# EAGLE design Skaarhoj_BI8-1x12CAP3slim (EAGLE 6.5.0)
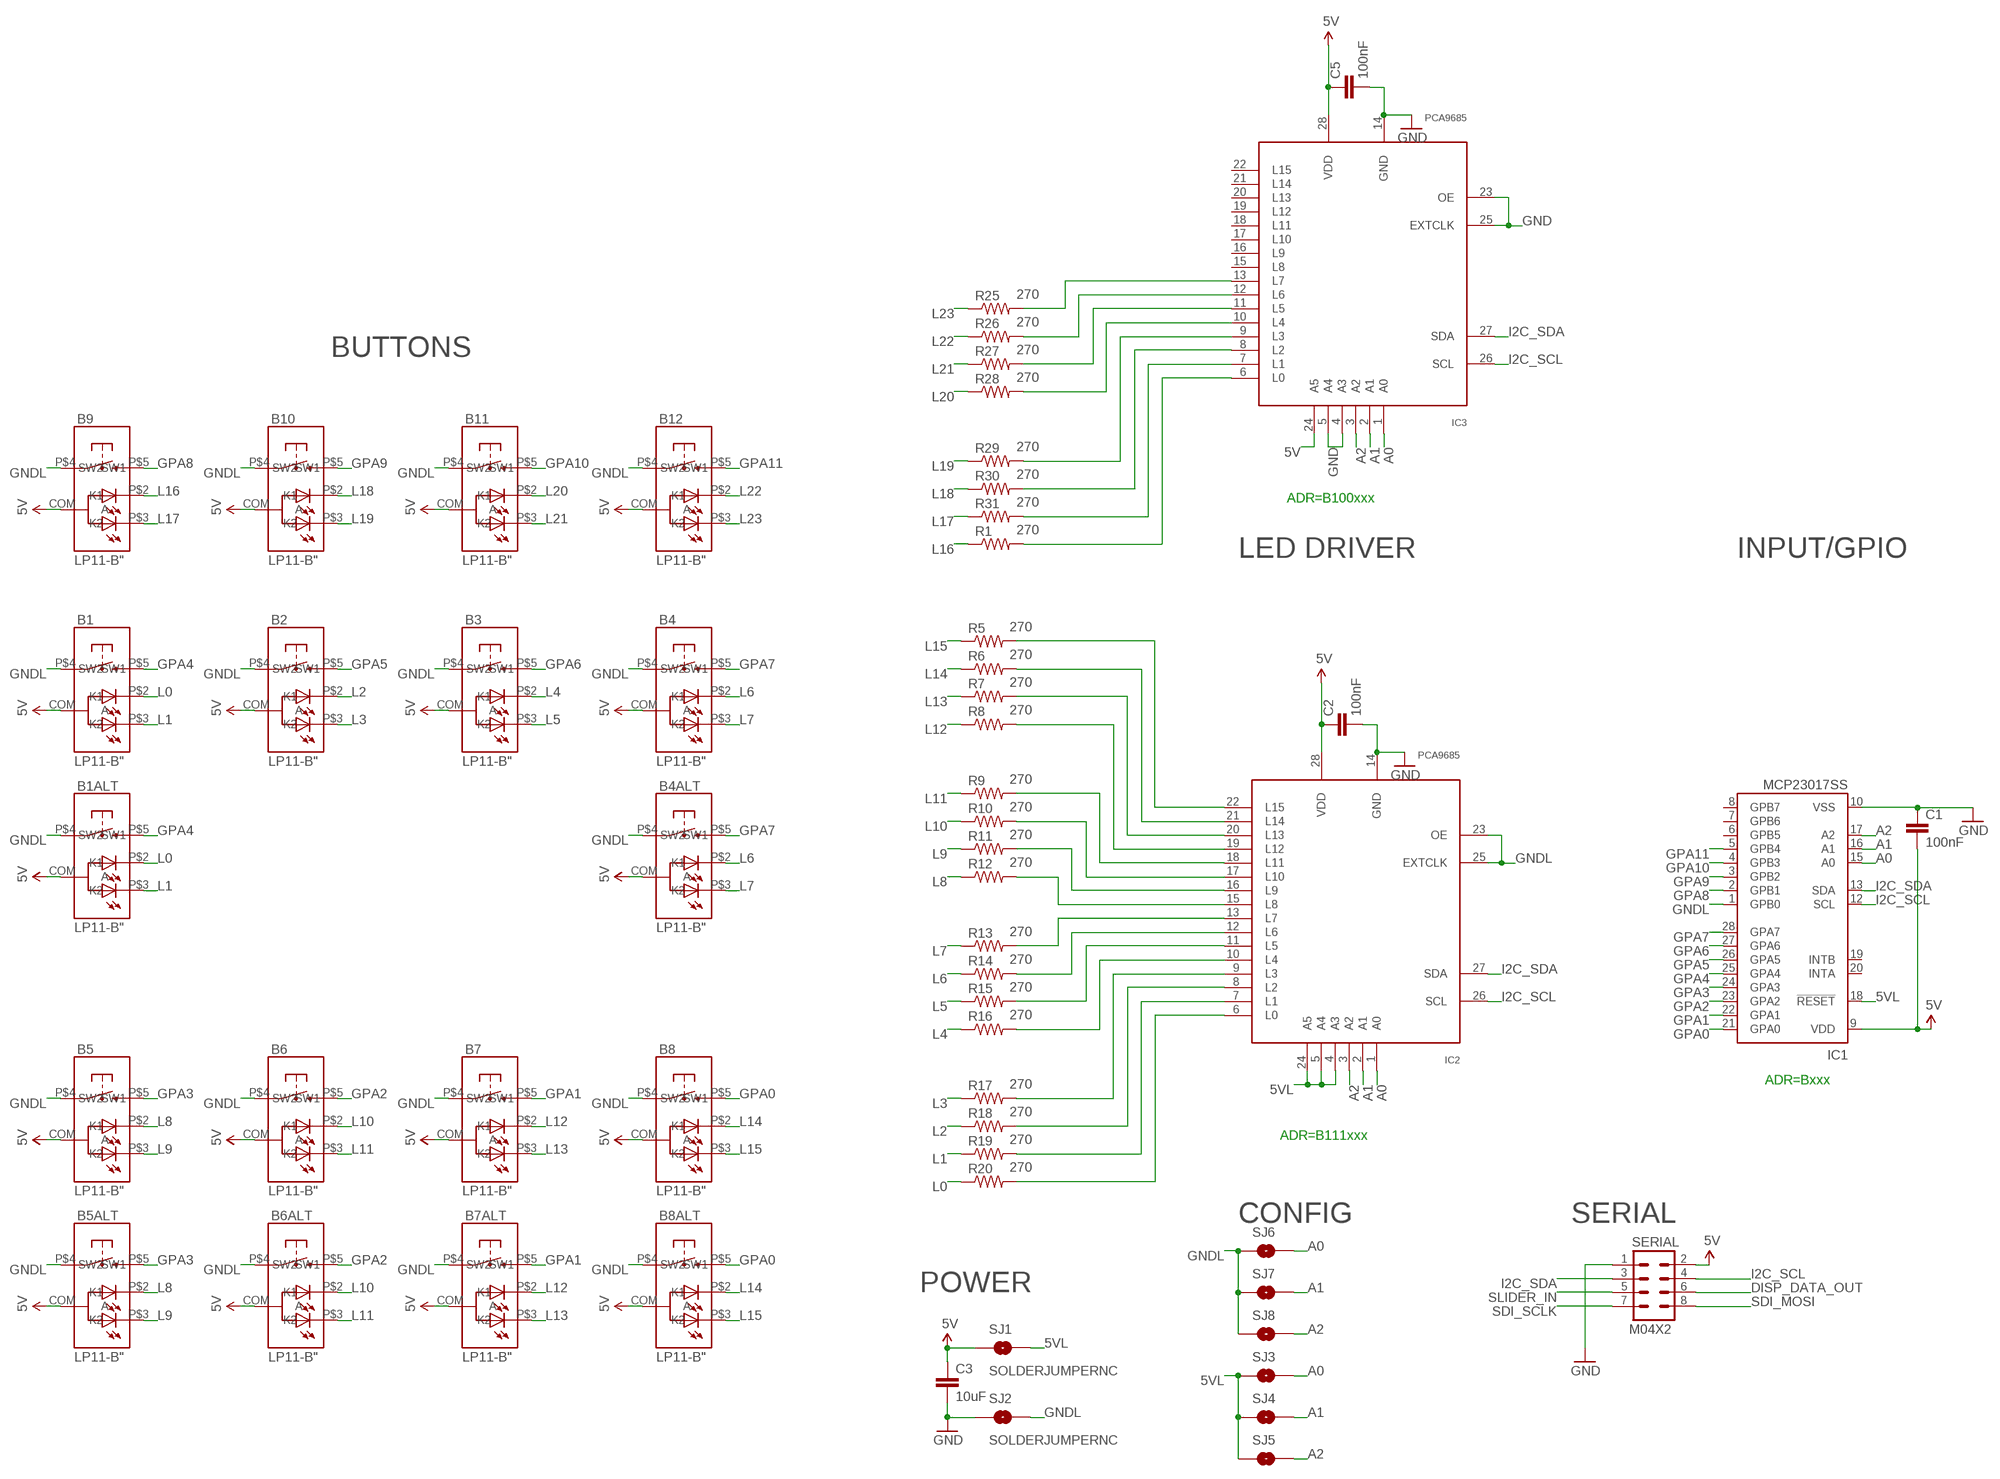
[diagram p0: schematic, sheet 1]

## Parts
B1  LP11-B"  [LP11]
B1ALT  LP11-B"  [LP11]
B2  LP11-B"  [LP11]
B3  LP11-B"  [LP11]
B4  LP11-B"  [LP11]
B4ALT  LP11-B"  [LP11]
B5  LP11-B"  [LP11]
B5ALT  LP11-B"  [LP11]
B6  LP11-B"  [LP11]
B6ALT  LP11-B"  [LP11]
B7  LP11-B"  [LP11]
B7ALT  LP11-B"  [LP11]
B8  LP11-B"  [LP11]
B8ALT  LP11-B"  [LP11]
B9  LP11-B"  [LP11]
B10  LP11-B"  [LP11]
B11  LP11-B"  [LP11]
B12  LP11-B"  [LP11]
C1  100nF  CAP0603-CAP  [0603-CAP]
C2  100nF  CAP0603-CAP  [0603-CAP]
C3  10uF  CAP0805  [0805]
C5  100nF  CAP0603-CAP  [0603-CAP]
IC1  MCP23017SS  [SSOP28]
IC2  PCA9685  [TSSOP28]
IC3  PCA9685  [TSSOP28]
R1  270  RESISTOR0603-RES  [0603-RES]
R5  270  RESISTOR0603-RES  [0603-RES]
R6  270  RESISTOR0603-RES  [0603-RES]
R7  270  RESISTOR0603-RES  [0603-RES]
R8  270  RESISTOR0603-RES  [0603-RES]
R9  270  RESISTOR0603-RES  [0603-RES]
R10  270  RESISTOR0603-RES  [0603-RES]
R11  270  RESISTOR0603-RES  [0603-RES]
R12  270  RESISTOR0603-RES  [0603-RES]
R13  270  RESISTOR0603-RES  [0603-RES]
R14  270  RESISTOR0603-RES  [0603-RES]
R15  270  RESISTOR0603-RES  [0603-RES]
R16  270  RESISTOR0603-RES  [0603-RES]
R17  270  RESISTOR0603-RES  [0603-RES]
R18  270  RESISTOR0603-RES  [0603-RES]
R19  270  RESISTOR0603-RES  [0603-RES]
R20  270  RESISTOR0603-RES  [0603-RES]
R25  270  RESISTOR0603-RES  [0603-RES]
R26  270  RESISTOR0603-RES  [0603-RES]
R27  270  RESISTOR0603-RES  [0603-RES]
R28  270  RESISTOR0603-RES  [0603-RES]
R29  270  RESISTOR0603-RES  [0603-RES]
R30  270  RESISTOR0603-RES  [0603-RES]
R31  270  RESISTOR0603-RES  [0603-RES]
SERIAL  M04X2  [2X4]
SJ1  SOLDERJUMPERNC  [SJ_2S]
SJ2  SOLDERJUMPERNC  [SJ_2S]
SJ3  SOLDERJUMPERNC  [SJ_2S]
SJ4  SOLDERJUMPERNC  [SJ_2S]
SJ5  SOLDERJUMPERNC  [SJ_2S]
SJ6  SOLDERJUMPERNC  [SJ_2S]
SJ7  SOLDERJUMPERNC  [SJ_2S]
SJ8  SOLDERJUMPERNC  [SJ_2S]

## Nets
5V [Power]: B1.COM(A) B1ALT.COM(A) B2.COM(A) B3.COM(A) B4.COM(A) B4ALT.COM(A) B5.COM(A) B5ALT.COM(A) B6.COM(A) B6ALT.COM(A) B7.COM(A) B7ALT.COM(A) B8.COM(A) B8ALT.COM(A) B9.COM(A) B10.COM(A) B11.COM(A) B12.COM(A) C1.2 C2.1 C3.1 C5.1 IC1.9(VDD) IC2.28(VDD) IC3.24(A5) IC3.28(VDD) SERIAL.2 SJ1.1
5VL: IC1.18(!RESET) IC2.4(A3) IC2.5(A4) IC2.24(A5) SJ1.2 SJ3.1 SJ4.1 SJ5.1
A0: IC1.15(A0) IC2.1(A0) IC3.1(A0) SJ3.2 SJ6.2
A1: IC1.16(A1) IC2.2(A1) IC3.2(A1) SJ4.2 SJ7.2
A2: IC1.17(A2) IC2.3(A2) IC3.3(A2) SJ5.2 SJ8.2
DISP_DATA_OUT: SERIAL.6
GND [Power]: C1.1 C2.2 C3.2 C5.2 IC1.10(VSS) IC2.14(GND) IC3.4(A3) IC3.5(A4) IC3.14(GND) IC3.23(OE) IC3.25(EXTCLK) SERIAL.1 SJ2.1
GNDL: B1.P$4(SW1) B1ALT.P$4(SW1) B2.P$4(SW1) B3.P$4(SW1) B4.P$4(SW1) B4ALT.P$4(SW1) B5.P$4(SW1) B5ALT.P$4(SW1) B6.P$4(SW1) B6ALT.P$4(SW1) B7.P$4(SW1) B7ALT.P$4(SW1) B8.P$4(SW1) B8ALT.P$4(SW1) B9.P$4(SW1) B10.P$4(SW1) B11.P$4(SW1) B12.P$4(SW1) IC1.1(GPB0) IC2.23(OE) IC2.25(EXTCLK) SJ2.2 SJ6.1 SJ7.1 SJ8.1
GPA0: B8.P$5(SW2) B8ALT.P$5(SW2) IC1.21(GPA0)
GPA1: B7.P$5(SW2) B7ALT.P$5(SW2) IC1.22(GPA1)
GPA2: B6.P$5(SW2) B6ALT.P$5(SW2) IC1.23(GPA2)
GPA3: B5.P$5(SW2) B5ALT.P$5(SW2) IC1.24(GPA3)
GPA4: B1.P$5(SW2) B1ALT.P$5(SW2) IC1.25(GPA4)
GPA5: B2.P$5(SW2) IC1.26(GPA5)
GPA6: B3.P$5(SW2) IC1.27(GPA6)
GPA7: B4.P$5(SW2) B4ALT.P$5(SW2) IC1.28(GPA7)
GPA8: B9.P$5(SW2) IC1.2(GPB1)
GPA9: B10.P$5(SW2) IC1.3(GPB2)
GPA10: B11.P$5(SW2) IC1.4(GPB3)
GPA11: B12.P$5(SW2) IC1.5(GPB4)
I2C_SCL: IC1.12(SCL) IC2.26(SCL) IC3.26(SCL) SERIAL.4
I2C_SDA: IC1.13(SDA) IC2.27(SDA) IC3.27(SDA) SERIAL.3
L0: B1.P$2(K1) B1ALT.P$2(K1) R20.1
L1: B1.P$3(K2) B1ALT.P$3(K2) R19.1
L2: B2.P$2(K1) R18.1
L3: B2.P$3(K2) R17.1
L4: B3.P$2(K1) R16.1
L5: B3.P$3(K2) R15.1
L6: B4.P$2(K1) B4ALT.P$2(K1) R14.1
L7: B4.P$3(K2) B4ALT.P$3(K2) R13.1
L8: B5.P$2(K1) B5ALT.P$2(K1) R12.1
L9: B5.P$3(K2) B5ALT.P$3(K2) R11.1
L10: B6.P$2(K1) B6ALT.P$2(K1) R10.1
L11: B6.P$3(K2) B6ALT.P$3(K2) R9.1
L12: B7.P$2(K1) B7ALT.P$2(K1) R8.1
L13: B7.P$3(K2) B7ALT.P$3(K2) R7.1
L14: B8.P$2(K1) B8ALT.P$2(K1) R6.1
L15: B8.P$3(K2) B8ALT.P$3(K2) R5.1
L16: B9.P$2(K1) R1.1
L17: B9.P$3(K2) R31.1
L18: B10.P$2(K1) R30.1
L19: B10.P$3(K2) R29.1
L20: B11.P$2(K1) R28.1
L21: B11.P$3(K2) R27.1
L22: B12.P$2(K1) R26.1
L23: B12.P$3(K2) R25.1
N$1: IC3.13(L7) R25.2
N$2: IC3.12(L6) R26.2
N$3: IC3.11(L5) R27.2
N$4: IC2.13(L7) R13.2
N$5: IC2.12(L6) R14.2
N$6: IC3.10(L4) R28.2
N$7: IC2.11(L5) R15.2
N$8: IC3.9(L3) R29.2
N$9: IC2.10(L4) R16.2
N$10: IC2.9(L3) R17.2
N$11: IC2.8(L2) R18.2
N$12: IC2.7(L1) R19.2
N$13: IC3.8(L2) R30.2
N$14: IC3.7(L1) R31.2
N$15: IC3.6(L0) R1.2
N$19: IC2.6(L0) R20.2
N$20: IC2.15(L8) R12.2
N$21: IC2.16(L9) R11.2
N$22: IC2.17(L10) R10.2
N$23: IC2.18(L11) R9.2
N$24: IC2.19(L12) R8.2
N$25: IC2.20(L13) R7.2
N$26: IC2.21(L14) R6.2
N$27: IC2.22(L15) R5.2
SDI_MOSI: SERIAL.8
SDI_SCLK: SERIAL.7
SLIDER_IN: SERIAL.5
Unconnected: IC1.6(GPB5) IC1.7(GPB6) IC1.8(GPB7) IC1.19(INTB) IC1.20(INTA) IC3.15(L8) IC3.16(L9) IC3.17(L10) IC3.18(L11) IC3.19(L12) IC3.20(L13) IC3.21(L14) IC3.22(L15)

## Notes on the sheet
- BUTTONS
- ADR=B100xxx
- LED DRIVER | INPUT/GPIO
- ADR=Bxxx
- ADR=B111xxx
- CONFIG | SERIAL
- POWER

## Library data of the parts
B1 B1ALT B2-B4 B4ALT B5 B5ALT B6 B6ALT B7 B7ALT B8 B8ALT B9-B12 = SKAARHOJ:LP11-B
C1-C3 C5 = SparkFun:CAP: Capacitor Standard 0603 ceramic capacitor, and 0.1" leaded capacitor.
IC1 = microchip:MCP23017: http://ww1.microchip.com/downloads/en/DeviceDoc/21952a.pdf Source: http://ww1.microchip.com/downloads/en/DeviceDoc/21952a.pdf; MF: MICROCHIP; MPN: MCP23017-E/SS; OC_FARNELL: 1467674; OC_NEWARK: 31K2960
IC2 IC3 = wsmith:PCA9685
R1 R5-R20 R25-R31 = SparkFun:RESISTOR: Resistor Basic schematic elements and footprints for 0603, 1206, and PTH resistors.
SERIAL = SparkFun:M04X2
SJ1-SJ8 = SparkFun:SOLDERJUMPER: Solder Jumper Standard SMD solder jumper. Used to automate production. Two varients : Normally Open and Normally Closed are the same, but have different paste layers. NC will have a large amount of paste and should jumper during reflow.

## Net classes
0 default: width 0.152 mm, drill 0.406 mm, clearance 0.152 mm
1 Power: width 0.406 mm, drill 0.61 mm, clearance 0.152 mm

## Board
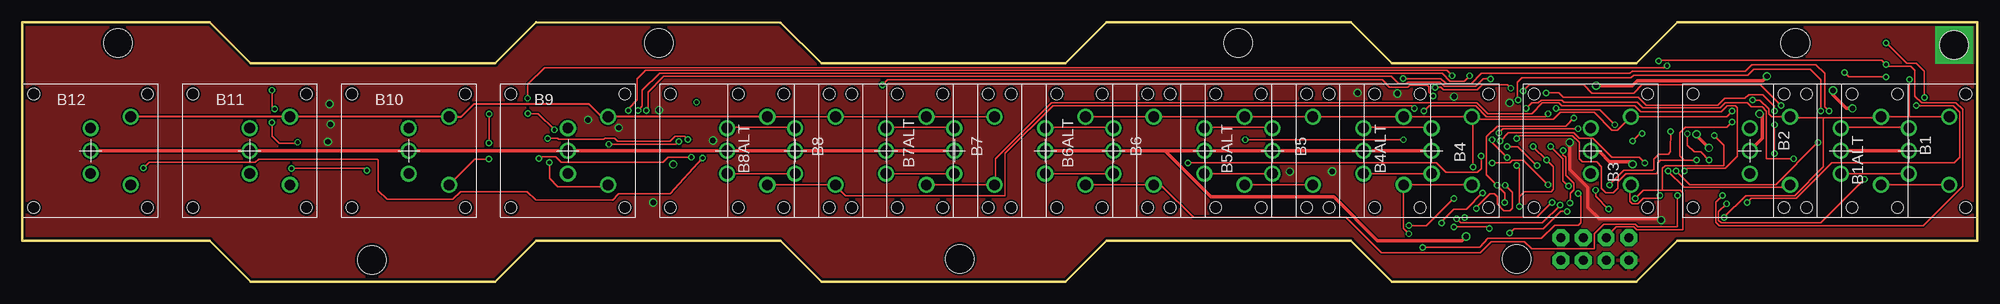
[diagram p1: board, top side]
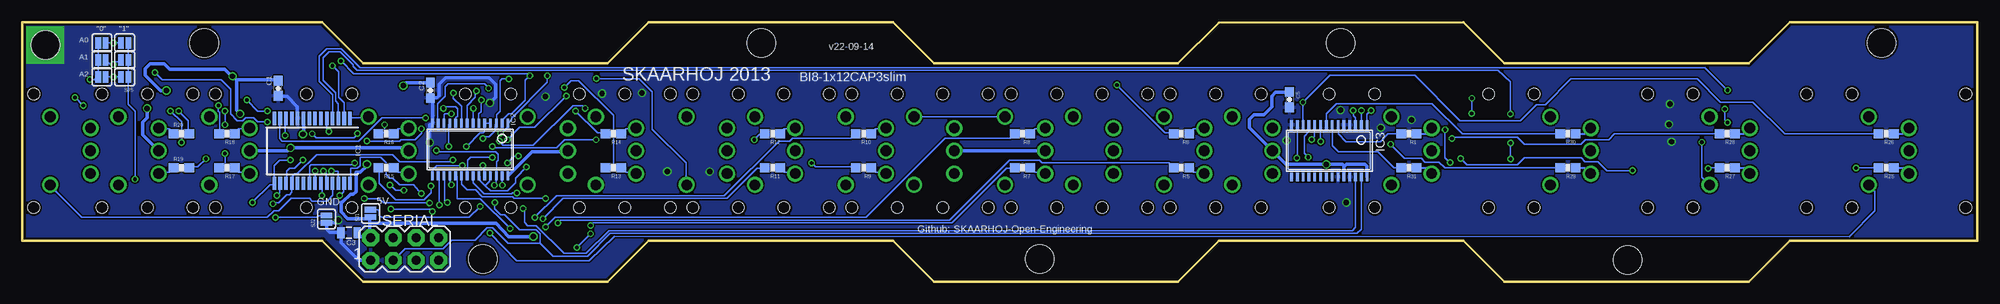
[diagram p2: board, bottom side, seen from below]

Size 218.44 x 28.96 mm. Coordinates in mm from the lower left corner, seen from the top.
Outline: 0,28.96 20.95,28.96 25.53,24.38 52.83,24.38 57.4,28.96 84.71,28.93 89.28,24.38 116.59,24.38 121.16,28.96 148.46,28.96 153.03,24.38 180.34,24.38 184.91,28.96 218.44,28.96 218.44,4.57 184.91,4.57 180.34,0 153.03,0 148.46,4.57 121.16,4.57 116.59,0 89.28,0 84.71,4.57 57.4,4.57 52.83,0 25.53,0 20.95,4.57 0,4.57 0,28.96
Copper layers (1*16): Top 0.035mm / dielectric 1.5mm / Bottom 0.035mm
Design rules "Fusion_eagle_rule_v1.1": minimum track width 6mil, minimum drill 12mil, track to track 6mil, track to pad 6mil, pad to pad 6mil, via to via 6mil, smd to smd 0mil, copper to edge 10mil, drill to drill 10mil, minimum pad ring 10mil, minimum via ring 6mil, stop-mask expansion 2mil, vias tented up to drill 100mil, thermal gap 10mil
Holes 3.2 mm at 71.12,26.67 104.77,2.54 167,2.54 135.89,26.67 198.12,26.67 39.07,2.41 215.87,26.44 10.67,26.67

### Footprints (pad centres in the part's own frame; a part is rotated, then mirrored left to right if it is on the bottom)
LP11 = drill 1.2: COM 0,0; P$2 0,2.54; P$3 0,-2.54; P$4 4.5,3.81; P$5 4.5,-3.81 | hole 1.3: -6.35,6.35; 6.35,6.35; 6.35,-6.35; -6.35,-6.35
0603-CAP = smd 1.1 x 1: 1 -0.85,0; 2 0.85,0
0805 = smd 0.8 x 1.2: 1 -0.9,0; 2 0.9,0
SSOP28 = smd 0.4 x 1.5: 1 -4.225,-3.625; 2 -3.575,-3.625; 3 -2.925,-3.625; 4 -2.275,-3.625; 5 -1.625,-3.625; 6 -0.975,-3.625; 7 -0.325,-3.625; 8 0.325,-3.625; 9 0.975,-3.625; 10 1.625,-3.625; 11 2.275,-3.625; 12 2.925,-3.625; 13 3.575,-3.625; 14 4.225,-3.625; 15 4.225,3.625; 16 3.575,3.625; 17 2.925,3.625; 18 2.275,3.625; 19 1.625,3.625; 20 0.975,3.625; 21 0.325,3.625; 22 -0.325,3.625; 23 -0.975,3.625; 24 -1.625,3.625; 25 -2.275,3.625; 26 -2.925,3.625; 27 -3.575,3.625; 28 -4.225,3.625
TSSOP28 = smd 0.305 x 0.991: 1 -4.225,-2.918; 2 -3.575,-2.918; 3 -2.925,-2.918; 4 -2.275,-2.918; 5 -1.625,-2.918; 6 -0.975,-2.918; 7 -0.325,-2.918; 8 0.325,-2.918; 9 0.975,-2.918; 10 1.625,-2.918; 11 2.275,-2.918; 12 2.925,-2.918; 13 3.575,-2.918; 14 4.225,-2.918; 15 4.225,2.918; 16 3.575,2.918; 17 2.925,2.918; 18 2.275,2.918; 19 1.625,2.918; 20 0.975,2.918; 21 0.325,2.918; 22 -0.325,2.918; 23 -0.975,2.918; 24 -1.625,2.918; 25 -2.275,2.918; 26 -2.925,2.918; 27 -3.575,2.918; 28 -4.225,2.918
0603-RES = smd 1.1 x 1: 1 -0.85,0; 2 0.85,0
2X4 = drill 1.016 pad 1.88 octagon: 1 -3.81,-1.27; 2 -3.81,1.27; 3 -1.27,-1.27; 4 -1.27,1.27; 5 1.27,-1.27; 6 1.27,1.27; 7 3.81,-1.27; 8 3.81,1.27
SJ_2S = smd 0.635 x 1.27: 1 -0.412,0; 2 0.412,0

### Placement (x,y rotation side)
B1  210.82,14.61 0 top
B1ALT  203.2,14.61 0 top
B2  193.04,14.61 0 top
B3  175.26,14.61 0 top
B4  157.48,14.61 0 top
B4ALT  149.86,14.61 0 top
B5  139.7,14.61 0 top
B5ALT  132.08,14.61 0 top
B6  121.92,14.61 0 top
B6ALT  114.3,14.61 0 top
B7  104.14,14.61 0 top
B7ALT  96.52,14.61 0 top
B8  86.36,14.61 0 top
B8ALT  78.74,14.61 0 top
B9  60.96,14.61 0 top
B10  43.18,14.61 0 top
B11  25.4,14.61 0 top
B12  7.62,14.61 0 top
C1  189.87,21.59 90 bottom
C2  172.85,21.36 270 bottom
C3  181.94,5.46 180 bottom
C5  76.83,20.32 270 bottom
IC1  186.06,14.61 180 bottom
IC2  168.4,14.76 180 bottom
IC3  72.39,14.61 180 bottom
R1  63.5,16.51 180 bottom
R5  88.9,12.7 180 bottom
R6  88.9,16.51 180 bottom
R7  106.68,12.7 180 bottom
R8  106.68,16.51 180 bottom
R9  124.46,12.7 180 bottom
R10  124.46,16.51 180 bottom
R11  134.62,12.7 180 bottom
R12  134.62,16.51 180 bottom
R13  152.4,12.7 180 bottom
R14  152.4,16.51 180 bottom
R15  177.8,12.7 180 bottom
R16  177.8,16.51 180 bottom
R17  195.58,12.7 180 bottom
R18  195.58,16.51 180 bottom
R19  200.66,12.7 0 bottom
R20  200.66,16.51 0 bottom
R25  10.16,12.7 180 bottom
R26  10.16,16.51 180 bottom
R27  27.94,12.7 180 bottom
R28  27.94,16.51 180 bottom
R29  45.72,12.7 180 bottom
R30  45.72,16.51 180 bottom
R31  63.5,12.7 180 bottom
SERIAL  175.72,3.63 0 bottom
SJ1  179.53,7.62 90 bottom
SJ2  184.45,6.98 90 bottom
SJ3  207.01,26.67 180 bottom
SJ4  207.01,24.77 180 bottom
SJ5  207.01,22.86 180 bottom
SJ6  209.55,26.67 0 bottom
SJ7  209.55,24.77 0 bottom
SJ8  209.55,22.86 0 bottom

### Tracks (layer width: path | path; a pad name or v marks a point on that pad's centre or on a via)
5V  (via drill 0.61)
  Top 0.406: v179.93,13.11 179.63,13.41 177.34,13.41 176.28,14.48 175.36,14.48 B3.COM | B1ALT.COM 203.25,14.63 210.72,14.63 B1.COM | v194.11,18.75 194.41,18.75 194.41,16 193.04,14.63 B2.COM | B7.COM 104.04,14.63 96.57,14.63 B7ALT.COM 96.42,14.63 86.51,14.63 B8.COM 86.36,14.63 78.74,14.63 B8ALT.COM B9.COM B10.COM B11.COM B12.COM | B4.COM 157.38,14.63 149.91,14.63 B4ALT.COM 149.76,14.63 139.85,14.63 B5.COM 139.7,14.63 132.08,14.63 B5ALT.COM 131.93,14.63 127.81,14.63 | B6ALT.COM 114.4,14.63 121.87,14.63 B6.COM 122.02,14.63 127.81,14.63 | v161.34,5.03 160.88,4.57 151.43,4.57 146.56,9.45 132.84,9.45 127.81,14.48 127.81,14.63 | v202.34,21.34 202.34,20.85 203.83,19.36 v204.5,19.36 | v187.1,16.46 187.1,16.31 v188.47,14.93 | v175.87,21.88 179.92,21.88 180.49,22.45 194.46,22.45 v194.94,22.94
  Bottom 0.406: C3.1 181,5.33 180.7,5.03 179.63,5.03 SERIAL.2 179.63,5.18 179.65,6.5 | 179.65,6.5 179.63,7.16 SJ1.1 179.78,7.01 182.07,7.01 182.83,7.77 182.83,8.84 182.68,8.84 181.76,9.75 181.46,9.75 181.15,10.06 181.15,12.19 180.7,12.19 179.93,12.95 v179.93,13.11 | B2.COM 193.04,14.63 188.77,14.63 v188.47,14.93 175.67,14.93 175.36,14.63 B3.COM | 173.08,22.4 172.92,22.25 C2.1 175.54,22.21 v175.87,21.88 | 189.84,22.4 C1.2 | 203.25,14.63 B1ALT.COM 205,16.41 205,17.8 204.5,18.31 v204.5,19.36 | C1.2 189.99,22.55 194.56,22.55 v194.94,22.94 | 189.84,22.25 C1.2 | IC2.28 164.08,11.89 161.49,14.48 157.53,14.48 B4.COM | B7.COM 104.19,14.63 114.25,14.63 B6ALT.COM | 179.65,6.5 165.49,6.5 164.1,5.03 v161.34,5.03 | IC3.24 | C5.1 78.39,21.17 78.83,20.73 78.83,19.51 79.68,18.66 80.81,18.66 81.31,18.16 81.31,17.17 B8ALT.COM 77.23,13.09 v72.72,13.09 70.93,13.09 70.69,12.86 | IC3.24 70.76,12.79 70.69,12.86 | IC3.28 68.16,12.86 68.39,13.08 70.47,13.08 70.69,12.86 | IC1.9 187.03,16.53 v187.1,16.46 | v194.11,18.75 194.49,19.13 194.49,22.48 v194.94,22.94 | v202.34,21.34 203,21.34 204.72,23.06 204.72,23.75 204.14,24.33 202.59,24.33 201.98,23.72 195.81,23.72 195.02,22.94 v194.94,22.94
5VL  (via drill 0.41)
  Top 0.152: v205.84,11.43 200.96,6.55 189.84,6.55 189.53,6.86 189.53,7.77 v190.45,8.69 | v166.98,12.95 167.28,12.65 167.28,9.45 | v167.28,8.38 167.28,9.45 | v168.81,15.09 v170.33,13.56 171.09,12.8 171.09,10.29 170.84,10.03 167.87,10.03 167.28,9.45
  Bottom 0.152: IC2.4 166.22,17.68 166.67,17.68 IC2.5 | SJ5.1 206.6,24.69 SJ4.1 206.6,24.84 SJ3.1 | SJ5.1 206.6,19.81 205.84,19.05 v205.84,11.43 | SJ5.1 | v167.28,8.38 168.5,7.16 178.31,7.16 178.55,7.4 178.55,7.87 178.69,8.01 179.51,8.01 SJ1.2 179.48,7.92 | IC2.24 166.83,11.89 166.83,12.8 v166.98,12.95 | v168.81,15.09 167.28,16.61 166.95,16.61 166.78,16.79 IC2.5 | 166.83,17.53 IC2.5 | v170.33,13.56 170.48,13.41 176.28,13.41 177.04,14.17 185.57,14.17 187.71,12.04 188.01,12.04 188.32,11.73 188.32,11.12 IC1.18 188.33,9.97 188.59,9.7 188.9,9.7 189.81,8.79 190.35,8.79 v190.45,8.69 | IC2.5
A0  (via drill 0.41)
  Top 0.152: v165,16.61 165.46,17.07 v173.84,17.07 | v188.47,13.56 187.55,14.48 186.82,14.48 186.05,15.24 v186.05,16.51 | v208.28,26.67 210.57,24.38 211.63,24.38 212.55,23.47 v212.55,20.57 | v211.63,19.66 215.75,19.66 216.51,18.9 216.51,13.89 215.87,13.26 202.18,13.26 198.22,9.3 193.19,9.3 v192.73,8.84 | v180.99,16.52 180.76,16.52 v179.93,15.7 | v67.73,19.1 67.73,19.3 68.72,20.29 68.72,22.66 69.66,23.6 159.19,23.6 v159.79,23
  Bottom 0.152: SJ6.2 v208.28,26.67 SJ3.2 | v165,16.61 164.85,16.61 164.24,17.22 164.24,17.53 IC2.1 | v179.93,15.7 176.28,15.7 176.12,15.85 174.55,15.85 173.84,16.56 v173.84,17.07 | 190.3,11.12 IC1.15 | v211.63,19.66 v212.55,20.57 | v192.73,8.84 190.75,10.82 190.3,10.82 190.14,10.97 IC1.15 | v180.99,16.52 v181,16.51 181,16.43 181.38,16.05 185.6,16.05 v186.05,16.51 | IC3.1 68.16,18.66 v67.73,19.1 | IC2.1 164.18,17.89 | v159.79,23 159.79,22.25 163.78,18.26 163.78,18.07 IC2.1 | v188.47,13.56 188.49,13.54 189.69,13.54 190.3,12.93 190.3,11 IC1.15
A1  (via drill 0.41)
  Top 0.152: v189.99,9.6 189.23,8.84 189.23,6.63 189.61,6.25 212.39,6.25 216.81,10.67 216.81,19.23 216.08,19.96 212.24,19.96 211.48,20.73 211.48,23.62 211.02,24.08 208.43,24.08 v208.28,24.23 207.8,24.71 182.89,24.71 v182.83,24.65 | v68.81,19.11 69.27,19.57 69.27,21.35 71.18,23.27 | 71.18,23.27 71.2,23.28 | 71.18,23.27 158.66,23.27 159.52,22.4 161.15,22.4 v161.75,23
  Bottom 0.152: IC2.2 164.69,17.68 164.69,18.14 164.08,18.75 163.78,18.75 162.25,20.27 162.25,22.49 v161.75,23 161.99,23.24 181.42,23.24 v182.83,24.65 | SJ4.2 207.37,24.69 207.52,24.54 207.97,24.54 v208.28,24.23 208.58,24.23 209.04,24.69 SJ7.2 | v189.99,9.6 189.69,9.91 189.69,10.97 IC1.16 | v68.81,19.11 68.81,17.53 IC3.2
A2  (via drill 0.41)
  Top 0.152: v166.98,16 167.28,16.31 173.23,16.31 173.99,15.54 173.99,13.72 174.32,13.39 175.93,13.39 176.47,12.85 176.47,10.4 176.94,9.93 177.81,9.93 178.28,10.4 178.28,11.15 179.2,12.06 182.57,12.06 182.75,12.24 182.75,13.3 183.02,13.56 185.7,13.56 | v187.1,13.56 185.7,13.56 | v191.06,17.83 190.45,17.22 185.85,17.22 185.23,16.6 185.23,14.03 185.7,13.56 | v69.71,19.11 69.9,19.3 69.9,21.17 71.65,22.92 152.97,22.92 153.8,22.1 154.61,22.1 154.81,22.29 158.41,22.29 158.9,21.79 162.41,21.79 163.27,22.66 v164.07,22.66 v164.08,22.64 | v208.28,22.86 204.09,22.86 v203.61,23.34
  Bottom 0.152: IC1.17 188.92,11.12 188.92,12.34 188.59,12.67 187.99,12.67 v187.1,13.56 | SJ8.2 v208.28,22.86 SJ5.2 | v203.61,23.34 202.79,22.55 196.24,22.55 195.17,21.49 195.17,18.75 194.41,17.98 193.8,17.98 193.5,18.29 192.58,18.29 192.13,17.83 v191.06,17.83 | v69.71,19.11 69.71,18.54 69.48,18.31 69.48,17.54 IC3.3 | v164.08,22.64 164.83,22.64 165.05,22.43 165.05,19.02 165.46,18.62 165.46,17.7 IC2.3 165.61,17.53 165.61,16.84 166.29,16.15 166.83,16.15 v166.98,16
GND  (via drill 0.61, 3.2)
  Top 0.406: v183.13,6.86 182.98,7.01 176.2,7.01 174.95,8.25 174.95,10.46 172.92,12.5 v172.92,15.54
  Bottom 0.406: 184.05,6.55 184.35,6.55 SJ2.1 | C3.2 182.98,5.49 184.1,5.49 184.45,5.84 SJ2.1 | 182.68,5.33 C3.2 | 189.84,20.73 C1.1 189.8,20.68 188.85,20.68 187.71,19.53 187.71,18.29 | v172.92,15.54 172.92,17.53 172.77,17.53 IC2.14 172.62,20.42 172.77,20.42 C2.2 172.15,20.51 171.88,20.78 171.88,22.02 171.14,22.76 166.29,22.76 165.58,22.05 165.58,20.57 v166.19,19.96 | SERIAL.1 180.87,2.36 182.83,4.32 182.83,5.45 C3.2 | SJ2.1 183.42,6.57 v183.13,6.86
  other vias: 215.87,26.44 63.21,18.07 34.15,15.62 66.64,17.18 34.44,17.56 34.33,19.84 71.15,19.15 77.18,15.76 149.2,21.08 153.66,21.01 159.98,20.66 146.37,12.31 141.63,12.28 70.5,8.83
  pour Top (isolate 0.165): -0.08,-0.64 218.36,-0.64 218.44,29.21 0,29.21
  pour Bottom (isolate 0.165): 0,-0.53 218.44,-0.53 218.44,29.21 0,29.21
GNDL  (via drill 0.41)
  Top 0.152: v190.14,7.16 192.58,9.6 198.07,9.6 201.27,12.8 201.27,18.29 | 201.27,18.29 197.61,18.29 B2.P$4 197.46,18.44 195.48,18.44 195.17,18.75 195.17,19.28 194.18,20.27 v193.34,20.27 | 201.27,18.29 207.67,18.29 B1ALT.P$4 207.82,18.44 210.87,18.44 | 210.87,18.44 215.29,18.44 B1.P$4 | 162.1,18.14 162.1,18.29 B4.P$4 161.95,18.44 154.48,18.44 B4ALT.P$4 154.33,18.44 144.27,18.44 B5.P$4 144.12,18.44 136.65,18.44 B5ALT.P$4 136.5,18.44 126.44,18.44 B6.P$4 126.29,18.44 118.82,18.44 B6ALT.P$4 | 162.1,18.14 v162.1,12.8 | 162.1,18.14 171.09,18.14 171.86,18.9 175.67,18.9 177.65,16.92 178.26,16.92 179.63,18.29 B3.P$4 179.78,18.44 190.45,18.44 v191.06,19.05 | B8ALT.P$4 83.31,18.44 90.78,18.44 B8.P$4 90.93,18.44 100.99,18.44 B7ALT.P$4 101.14,18.44 108.61,18.44 B7.P$4 | 210.87,18.44 v210.87,22.55
  Top 0.203: B8ALT.P$4 B9.P$4 64.73,18.41 63.3,19.85 50.46,19.85 49.02,18.41 B10.P$4 B11.P$4 B12.P$4
  Bottom 0.152: 184.51,7.31 SJ2.2 184.49,7.37 185.32,7.37 185.52,7.16 v190.14,7.16 | IC1.1 181.76,18.29 179.78,18.29 B3.P$4 | IC2.25 166.22,11.73 166.22,11.19 166.71,10.7 | IC2.23 167.28,11.73 167.28,11.28 166.71,10.7 | B6ALT.P$4 118.67,18.44 108.76,18.44 B7.P$4 | v193.34,20.27 192.13,19.05 v191.06,19.05 | SJ6.1 209.96,24.84 SJ7.1 209.96,24.69 SJ8.1 210.11,22.86 210.41,22.55 v210.87,22.55 | 166.71,10.7 166.13,10.12 164.24,10.12 163.33,11.02 163.33,11.57 v162.1,12.8
GPA0  (via drill 0.41)
  Top 0.152: v181.3,13.26 180.7,13.87 177.65,13.87 175.51,16 173.99,16 173.38,16.61 166.06,16.61 v165.15,15.7 | v155.55,19.36 155.24,19.66 115.16,19.66 109.83,14.33 109.83,9.6 92,9.6 90.93,10.67 B8.P$5 90.78,10.82 83.31,10.82 B8ALT.P$5
  Bottom 0.152: v165.15,15.7 164.69,15.24 161.34,15.24 156.92,19.66 155.85,19.66 v155.55,19.36 | IC1.21 186.33,11.12 186.33,12.88 186.16,13.06 181.51,13.06 v181.3,13.26
GPA1  (via drill 0.41)
  Top 0.152: v185.72,12.34 186.03,12.65 190.3,12.65 191.67,14.02 191.67,19.41 191.44,19.63 190.5,19.63 189.84,18.97 180.87,18.97 180.19,19.66 172.01,19.66 171.7,19.96 169.87,19.96 168.66,18.75 163.78,18.75 162.56,19.96 115.01,19.96 108.76,13.72 108.76,10.82 B7.P$5 108.61,10.82 101.14,10.82 B7ALT.P$5
  Bottom 0.152: v185.72,12.34 185.72,11.12 IC1.22
GPA2  (via drill 0.41)
  Top 0.152: v184.96,9.6 184.96,6.1 180.54,6.1 180.24,6.4 176.73,6.4 175.67,5.33 175.67,3.66 168.66,3.66 167.87,4.47 164.15,4.47 162.9,3.2 151.89,3.2 147.93,7.16 130.86,7.16 127.36,10.67 126.44,10.67 B6.P$5 126.29,10.82 118.82,10.82 B6ALT.P$5
  Bottom 0.152: v184.96,9.6 184.96,10.97 IC1.23
GPA3  (via drill 0.41)
  Top 0.152: v184.81,12.34 186.33,10.82 195.94,10.82 v200.66,15.54 | B5ALT.P$5 136.65,10.82 144.12,10.82 B5.P$5 | v154.28,22.68 158.53,22.68 159.06,22.15 | 159.06,22.15 159.11,22.1 | 159.06,22.15 159.11,22.1 161.9,22.1 163.07,23.27 179.65,23.27 179.91,23.52 192.53,23.52 193.24,24.23 200.43,24.23 201.4,23.27 201.4,19.53 v201.88,19.05
  Bottom 0.152: v184.81,12.34 184.51,12.34 184.51,11.12 IC1.24 | v201.88,19.05 200.66,17.83 v200.66,15.54 | B5.P$5 144.27,10.82 144.27,13.26 148.04,17.03 148.04,21.18 149.54,22.68 v154.28,22.68
GPA4
  Top 0.152: B1ALT.P$5 207.82,10.82 215.29,10.82 B1.P$5
  Bottom 0.152: 183.9,10.97 IC1.25 183.74,10.94 183.74,9.65 184.4,8.99 186.03,8.99 186.33,9.3 188.42,9.3 189.81,7.9 190.32,7.9 191.06,7.16 211.78,7.16 215.29,10.67 B1.P$5
GPA5  (via drill 0.41)
  Top 0.152: v183.9,12.34 185.72,10.52 197.31,10.52 197.46,10.67 B2.P$5
  Bottom 0.152: v183.9,12.34 183.13,12.34 183.13,11.12 IC1.26
GPA6  (via drill 0.41)
  Top 0.152: v182.98,9.6 182.68,9.3 181.15,9.3 180.54,8.69 179.93,8.69 179.63,8.99 179.63,10.67 B3.P$5
  Bottom 0.152: 182.83,9.75 v182.98,9.6 182.52,10.06 182.52,10.97 IC1.27
GPA7  (via drill 0.41)
  Top 0.152: v156.46,3.81 162.86,3.81 163.79,4.84 169.72,4.84 171.26,6.27 173.86,6.27 174.14,6.55 174.14,9.54 v173.85,9.83 | v154.94,5.33 154.33,5.94 154.33,10.67 B4ALT.P$5 154.48,10.82 161.95,10.82 B4.P$5
  Bottom 0.152: v154.94,5.33 v156.46,3.81 | IC1.28 181.76,11.12 181.76,12.65 181,12.65 180.7,12.95 180.7,13.87 178.41,13.87 177.8,13.26 177.8,11.99 177.38,11.57 177.04,11.57 176.26,10.79 174.73,10.79 v173.85,9.83
GPA8  (via drill 0.41)
  Top 0.152: v56.5,18.76 57.66,18.76 v59.46,16.95 | v58.9,13.28 58.9,11.53 59.82,10.62 65.28,10.62 B9.P$5 | v56.46,20.48 56.46,22.04 58.34,23.91 183.58,23.91 v183.78,24.12
  Bottom 0.152: v56.46,20.48 56.46,18.8 v56.5,18.76 | v59.46,16.95 59.46,13.84 v58.9,13.28 | IC1.2 182.48,19.97 183.08,20.57 183.08,23.42 v183.78,24.12
GPA9  (via drill 0.41)
  Top 0.152: v52.16,18.71 52.16,15.57 v52.15,15.49 | v52.13,13.68 50.56,13.68 B10.P$5
  Bottom 0.152: v52.15,15.49 52.15,13.69 v52.13,13.68 | v52.16,18.71 52.16,22.3 53.58,23.58 181,23.58 181.46,24.04 181.46,24.23 182.91,25.68 184.18,25.68 184.84,25.02 184.84,22.48 183.44,21.08 183.44,20.19 183.13,19.88 IC1.3
GPA10  (via drill 0.41)
  Top 0.152: v27.9,21.37 27.9,19.57 v28.19,19.28 | v27.9,17.78 27.9,16.24 28.68,15.47 30.66,15.47 v30.76,15.57
  Bottom 0.152: v28.19,19.28 28.19,18.07 v27.9,17.78 | v30.76,15.57 30.76,11.65 B11.P$5 | v27.9,21.37 30.44,23.91 180.7,23.91 182.82,26.04 184.43,26.04 185.29,25.17 185.29,22.38 183.78,20.86 IC1.4
GPA11  (via drill 0.41)
  Top 0.152: v184.19,16.78 184.18,14.64 184.18,14.48 183.91,14.21 182.85,14.21 182.32,13.68 182.32,12.56 182.17,12.41 178.98,12.41 v177.36,10.79 | v175.81,10.2 175.81,9.53 v177.24,8.09 | v172.62,7.84 171.94,7.84 169.99,5.88 166.73,5.88 v166.19,5.42
  Bottom 0.152: IC1.5 184.43,17.02 v184.19,16.78 | v177.24,8.09 173.05,8.08 172.86,8.08 v172.62,7.84 | B12.P$5 11.43,10.11 11.43,7.91 14.31,5.03 152.27,5.08 155.09,2.34 163.18,2.34 v166.19,5.42 | v175.81,10.2 176.75,10.18 v177.36,10.79
I2C_SCL  (via drill 0.41)
  Top 0.152: v172.16,14.63 172.16,14.17 172.47,13.87 172.47,11.89 173.38,10.97 173.38,10.26 172.96,9.84 172.96,8.81 v172.94,8.79 | v180.24,9.3 181.15,10.21 183.29,10.21 | 183.29,10.21 185.27,10.21 185.57,9.91 185.57,5.79 180.39,5.79 180.09,6.1 178.1,6.1 177.04,5.03 SERIAL.4 | v189.08,16.31 190.14,15.24 190.14,12.95 183.59,12.95 183.29,12.65 183.29,10.21 | v162.48,8.15 162.48,8.31 163.97,9.79 164.49,9.79 164.81,9.47 164.81,8.7 165.58,7.92 166.23,7.92 166.51,8.2 166.51,9.96 v165.71,10.76
  Bottom 0.152: v172.16,14.63 172.01,14.48 165.56,14.48 165.3,14.22 165.3,13.56 165.46,13.41 165.46,11.89 IC2.26 165.48,10.99 v165.71,10.76 | v189.08,16.31 189.08,18.14 IC1.12 | IC3.26 69.46,6.06 69.82,5.7 152.88,5.7 155.44,3.15 157.9,3.15 161.01,6.26 161.99,6.26 162.33,6.6 162.33,8 v162.48,8.15 | v172.94,8.79 178.07,8.79 178.55,9.27 180.21,9.27 v180.24,9.3
I2C_SDA  (via drill 0.41)
  Top 0.152: v173.38,18.29 172.47,17.37 164.85,17.37 163.63,16.15 163.63,11.92 v164.79,10.76 165.66,9.89 v165.66,8.84
  Bottom 0.152: 160.58,4.27 160.58,5.33 161.04,5.79 162.86,5.79 164.54,7.47 165,7.47 165.66,8.13 v165.66,8.84 | IC2.27 164.85,11.73 164.85,10.81 v164.79,10.76 | SERIAL.3 176.89,2.44 175.67,3.66 171.4,3.66 170.46,4.6 167.87,4.6 166.48,6.03 165.87,6.03 164.16,4.27 160.58,4.27 | v173.38,18.29 178.26,18.29 180.85,15.7 189.38,15.7 189.69,16 189.69,18.14 IC1.13 | IC3.27 68.81,5.85 69.29,5.38 152.74,5.38 155.3,2.82 159.13,2.82 160.58,4.27
L0
  Top 0.152: B1ALT.P$2 203.25,17.22 210.72,17.22 B1.P$2
  Bottom 0.152: R20.1 201.57,16.61 202.03,17.07 203.1,17.07 B1ALT.P$2
L1
  Top 0.152: B1ALT.P$3 203.25,12.04 210.72,12.04 B1.P$3
  Bottom 0.152: R19.1 201.57,12.65 202.03,12.19 203.1,12.19 B1ALT.P$3
L2
  Bottom 0.152: R18.1 194.72,16.61 194.26,17.07 193.04,17.07 B2.P$2
L3
  Bottom 0.152: R17.1 194.72,12.65 194.26,12.19 193.04,12.19 B2.P$3
L4
  Bottom 0.152: R16.1 176.89,16.61 176.43,17.07 175.36,17.07 B3.P$2
L5
  Bottom 0.152: R15.1 176.89,12.65 176.43,12.19 175.36,12.19 B3.P$3
L6
  Top 0.152: B4ALT.P$2 149.91,17.22 157.38,17.22 B4.P$2
  Bottom 0.152: R14.1 151.43,16.61 150.98,17.07 149.91,17.07 B4ALT.P$2
L7
  Top 0.152: B4ALT.P$3 149.91,12.04 157.38,12.04 B4.P$3
  Bottom 0.152: R13.1 151.43,12.65 150.98,12.19 149.91,12.19 B4ALT.P$3
L8
  Top 0.152: B5ALT.P$2 132.08,17.22 139.7,17.22 B5.P$2
  Bottom 0.152: R12.1 133.76,16.61 133.3,17.07 132.08,17.07 B5ALT.P$2
L9
  Top 0.152: B5ALT.P$3 132.08,12.04 139.7,12.04 B5.P$3
  Bottom 0.152: R11.1 133.76,12.65 133.3,12.19 132.08,12.19 B5ALT.P$3
L10
  Top 0.152: B6ALT.P$2 114.4,17.22 121.87,17.22 B6.P$2
  Bottom 0.152: R10.1 123.55,16.61 123.09,17.07 122.02,17.07 B6.P$2
L11
  Top 0.152: B6ALT.P$3 114.4,12.04 121.87,12.04 B6.P$3
  Bottom 0.152: R9.1 123.55,12.65 123.09,12.19 122.02,12.19 B6.P$3
L12
  Top 0.152: B7ALT.P$2 96.57,17.22 104.04,17.22 B7.P$2
  Bottom 0.152: R8.1 105.71,16.61 105.26,17.07 104.19,17.07 B7.P$2
L13
  Top 0.152: B7ALT.P$3 96.57,12.04 104.04,12.04 B7.P$3
  Bottom 0.152: R7.1 105.71,12.65 105.26,12.19 104.19,12.19 B7.P$3
L14
  Top 0.152: B8ALT.P$2 78.74,17.22 86.36,17.22 B8.P$2
  Bottom 0.152: R6.1 88.04,16.61 87.58,17.07 86.36,17.07 B8.P$2
L15
  Top 0.152: B8ALT.P$3 78.74,12.04 86.36,12.04 B8.P$3
  Bottom 0.152: R5.1 88.04,12.65 87.58,12.19 86.36,12.19 B8.P$3
L16
  Bottom 0.203: R1.1 61.59,16.51 B9.P$2
L17
  Bottom 0.203: R31.1 61.59,12.7 B9.P$3
L18
  Bottom 0.203: R30.1 43.81,16.51 B10.P$2
L19
  Bottom 0.203: R29.1 43.81,12.7 B10.P$3
L20
  Bottom 0.203: R28.1 26.03,16.51 B11.P$2
L21
  Bottom 0.203: R27.1 26.03,12.7 B11.P$3
L22
  Bottom 0.203: R26.1 8.25,16.51 B12.P$2
L23
  Bottom 0.203: R25.1 8.25,12.7 B12.P$3
N$1  (via drill 0.41)
  Top 0.152: v76.01,13.8 72.4,9.79 66.64,9.79 65.95,9.11 57.34,9.12 56.41,10.05 48.97,10.05 48.11,9.18 41.94,9.18 41.92,9.2 40.74,9.2 39.78,10.16 39.78,13.54 39.62,13.69 26.42,13.69 26.03,13.31 14.15,13.31 v13.54,12.7
  Bottom 0.152: IC3.13 75.96,13.86 v76.01,13.8 | v13.54,12.7 R25.2
N$2  (via drill 0.41)
  Bottom 0.152: R26.2 21.5,16.51 25.04,20.05 28.68,20.05 31.28,22.66 45.39,22.66 48.27,19.77 49.24,19.77 51.03,17.98 57.86,17.98 57.86,18.05 62.85,23.04 72.33,23.04 v75.34,20.03 75.34,17.54 IC3.12
N$3  (via drill 0.41)
  Top 0.152: v57.72,13.77 57.92,13.97 59.56,13.97 60.21,13.32 71.59,13.32 72.14,13.87 74.73,13.87 v74.74,13.88 | v30.05,12.65 38.25,12.65 v38.51,12.39
  Bottom 0.152: IC3.11 74.66,16.78 75.18,16.26 75.18,14.33 v74.74,13.88 | v57.72,13.77 57,13.04 51.36,13.04 50.6,13.8 44.23,13.8 43.83,13.4 42.38,13.4 41.38,12.39 v38.51,12.39 | R27.2 30.12,12.7 v30.05,12.65
N$4  (via drill 0.41)
  Top 0.152: v157.87,21.69 158.52,21.69 158.78,21.44 162.61,21.44 163.14,21.97 165.96,21.97 v166.33,21.6
  Bottom 0.152: IC2.13 172.01,17.68 172.01,19.89 171.17,20.73 171.17,21.77 170.87,22.07 166.8,22.07 v166.33,21.6 | R13.2 153.11,12.8 152.35,12.8 152.35,18.59 156.26,22.45 157.11,22.45 v157.87,21.69
N$5  (via drill 0.41)
  Top 0.152: v170.48,18.75 170.18,18.44 163.63,18.44 162.41,19.66 157.23,19.66 v156.62,19.05
  Bottom 0.152: v156.62,19.05 154.18,16.61 153.26,16.61 R14.2 | IC2.12 171.33,18.64 171.22,18.75 v170.48,18.75
N$6  (via drill 0.41)
  Top 0.152: v58.7,16 59.82,16 59.94,15.88 64.95,15.88 65.1,16.03 66.17,16.03 66.53,15.66 72.38,15.66 72.96,16.24 74.02,16.24 v74.37,15.89
  Bottom 0.152: R28.2 40.51,16.51 41.16,15.86 43.8,15.86 44.31,15.35 50.61,15.35 51.36,16.1 58.6,16.1 v58.7,16 | IC3.10 74.04,17.5 74.04,16.22 v74.37,15.89
N$7  (via drill 0.41)
  Top 0.152: v170.79,15.09 172.16,13.72 172.16,11.28 v172.77,10.67
  Bottom 0.152: v170.79,15.09 170.79,17.53 IC2.11 | R15.2 178.56,12.65 178.56,10.97 176.71,9.12 173.56,9.12 172.77,9.91 v172.77,10.67
N$8  (via drill 0.41)
  Top 0.152: v65.56,15.34 73.06,15.34 v73.37,15.65
  Bottom 0.152: R29.2 59.47,12.7 60.12,13.35 61.68,13.35 62.13,13.79 64.01,13.79 v65.56,15.34 | v73.37,15.65 IC3.9
N$9  (via drill 0.41)
  Top 0.152: v171.4,19.36 171.55,19.2 176.28,19.2 v177.95,17.53
  Bottom 0.152: v177.95,17.53 177.95,16.61 178.56,16.61 R16.2 | IC2.10 170.03,18.29 169.82,18.49 169.82,19.33 170,19.51 171.25,19.51 v171.4,19.36
N$10  (via drill 0.41)
  Top 0.152: v195.78,14.33 v195.78,17.53 | v170.28,21.08 171.68,21.08 172.19,20.57 180.59,20.57 181.46,19.71 189.46,19.71 190.22,20.47 192.51,20.47 192.91,20.88 194.49,20.88 195.78,19.58 v195.78,19.05
  Bottom 0.152: v195.78,17.53 v195.78,19.05 | v195.78,14.33 195.78,12.8 196.39,12.8 R17.2 | IC2.9 169.38,19.57 170.28,20.47 v170.28,21.08
N$11  (via drill 0.41)
  Top 0.152: v196.54,19.66 194.23,21.97 180.97,21.97 180.06,21.06 175.41,21.06 174.47,22 168.4,22 v167.69,21.29
  Bottom 0.152: v196.54,19.66 196.54,19.05 196.39,18.9 196.39,16.61 R18.2 | IC2.8 168.73,19.66 167.82,20.57 167.82,21.16 v167.69,21.29
N$12  (via drill 0.41)
  Top 0.152: v168.05,19.36 168.66,19.96 169.42,19.96 169.72,20.27 172.03,20.27 172.26,20.04 180.47,20.04 181.1,19.41 189.76,19.41 190.32,19.96 192.73,19.96 193.19,19.51 194.41,19.51 194.87,19.05 194.87,13.72 v197.92,13.72
  Bottom 0.152: v168.05,19.36 168.05,17.68 IC2.7 | v197.92,13.72 198.83,12.8 199.75,12.8 R19.2
N$13
  Bottom 0.152: R30.2 57.54,16.51 60.91,19.88 71.58,19.88 72.69,18.76 72.69,17.54 IC3.8
N$14
  Bottom 0.152: IC3.7 72.06,15.19 71.36,14.49 66.94,14.49 65.15,12.7 R31.2
N$15
  Bottom 0.152: R1.2 65.82,16.51 66.7,15.63 70.52,15.63 71.4,16.51 71.4,17.51 IC3.6
N$19  (via drill 0.41)
  Top 0.152: v200.96,19.05 200.96,22.53 199.77,23.72 193.5,23.72 192.84,23.06 180.06,23.06 179.76,22.76 167.59,22.76 167.08,22.25 167.08,20.37 v167.16,20.29
  Bottom 0.152: v200.96,19.05 199.9,17.98 199.9,16.61 R20.2 | IC2.6 167.43,18.73 167.16,19 v167.16,20.29
N$20  (via drill 0.41)
  Top 0.152: v169.27,12.95 167.13,15.09 v165.91,15.09 | v136.65,15.85 v154.33,15.85
  Bottom 0.152: v165.91,15.09 165.76,14.93 158.75,14.93 157.84,15.85 v154.33,15.85 | v136.65,15.85 136.04,16.46 135.58,16.46 R12.2 | 172.62,11.89 IC2.15 172.62,12.47 172.14,12.95 v169.27,12.95
N$21  (via drill 0.41)
  Top 0.152: v160.27,7.01 160.73,6.55 169.87,6.55 v171.86,8.53
  Bottom 0.152: v171.86,8.53 171.86,11.73 IC2.16 | v160.27,7.01 157.99,9.3 139.7,9.3 136.35,12.65 135.58,12.65 R11.2
N$22  (via drill 0.41)
  Top 0.152: v170.94,8.84 169.27,7.16 v161.19,7.16
  Bottom 0.152: v170.94,8.84 171.25,8.84 171.25,11.73 IC2.17 | v161.19,7.16 158.75,9.6 140,9.6 133.91,15.7 132.69,15.7 132.38,16 125.83,16 125.37,16.46 R10.2
N$23  (via drill 0.41)
  Top 0.152: v170.48,10.82 167.74,13.56 166.52,13.56 166.22,13.26 v164.24,13.26 | v130.25,13.26 157.99,13.26 159.05,12.19 162.59,12.19 163.02,12.62 v163.02,14.02
  Bottom 0.152: v170.48,10.82 170.64,10.82 170.64,11.73 IC2.18 | v164.24,13.26 163.47,14.02 v163.02,14.02 | v130.25,13.26 129.79,12.8 125.37,12.8 R9.2
N$24  (via drill 0.41)
  Top 0.152: v163.93,5.94 163.78,6.1 v159.97,6.1
  Bottom 0.152: v163.93,5.94 167.28,9.26 169.87,9.26 169.87,11.73 IC2.19 | v159.97,6.1 158.9,7.16 124.15,7.16 115.32,16 108,16 107.54,16.46 R8.2
N$25  (via drill 0.41)
  Top 0.152: v159.97,9.3 156.92,6.25 v154.94,6.25
  Bottom 0.152: v159.97,9.3 163.47,9.3 163.68,9.5 167.06,9.5 167.79,10.24 168.72,10.24 169.38,10.9 IC2.20 | v154.94,6.25 154.63,6.55 114.55,6.55 108.46,12.65 107.54,12.65 R7.2
N$26  (via drill 0.41)
  Top 0.152: v165.91,13.87 164.24,15.54 v164.24,15.85 | v96.11,21.95 96.7,22.53 151.97,22.53 152.78,21.72 154.84,21.72 155.07,21.95 157,21.95 157.17,21.77 157.17,21.22 v157.67,20.73
  Bottom 0.152: v164.24,15.85 162.86,17.22 161.18,17.22 v157.67,20.73 | v96.11,21.95 90.78,16.61 89.86,16.61 R6.2 | 168.66,11.89 IC2.21 168.73,12.45 168.66,12.52 168.66,13.56 168.35,13.87 v165.91,13.87
N$27  (via drill 0.41)
  Top 0.152: v163.17,9.91 161.34,8.08 159.97,8.08 158.6,6.71 v158.6,6.55
  Bottom 0.152: v158.6,6.55 158.29,6.86 114.86,6.86 108.15,13.56 104.8,13.56 104.5,13.26 90.32,13.26 89.86,12.8 R5.2 | 168.05,11.73 IC2.22 168.07,11.05 166.83,9.8 163.74,9.8 163.64,9.91 v163.17,9.91

### Text on the board
_bsilk: "1" | "0" | v22-09-14 | A0 | A1 | A2 | BI8-1x12CAP3slim | SKAARHOJ 2013 | GND | 5V | Github: SKAARHOJ-Open-Engineering | 1